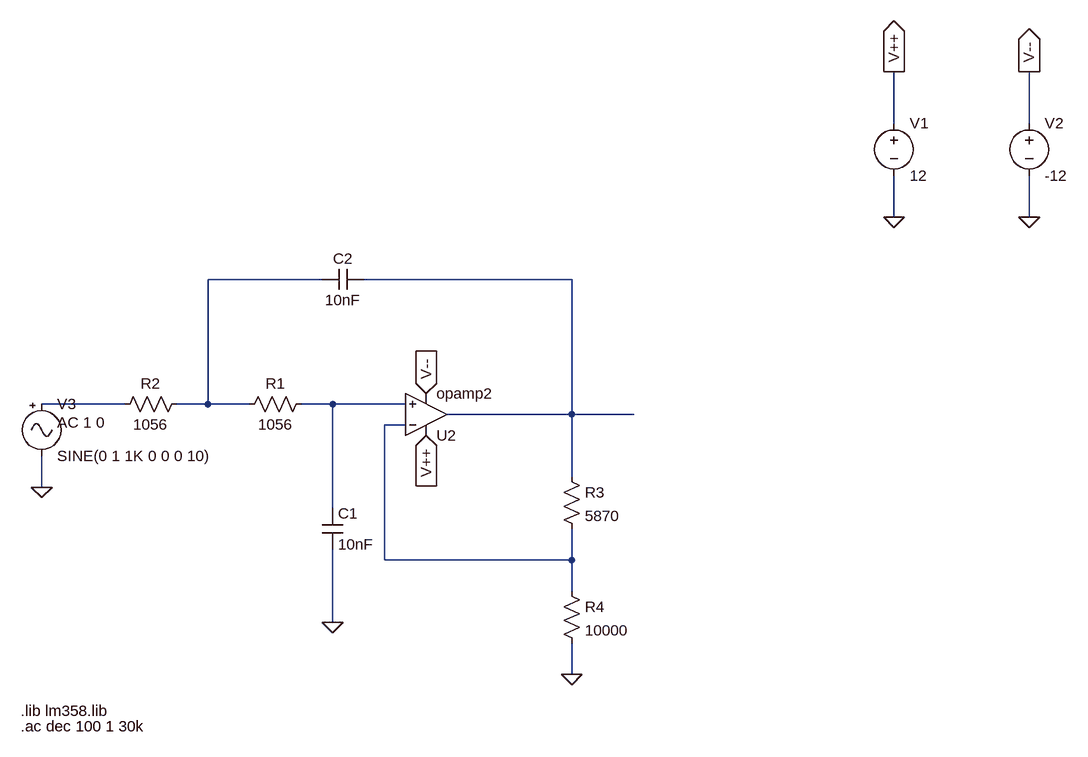
[diagram p0: schematic EEE3090F_2023_lowPassFilter_GNGJOA003.asc]
EEE3090F_2023_lowPassFilter_GNGJOA003.asc, the LTspice schematic file:
Version 4
SHEET 1 1356 680
WIRE 1072 -608 1072 -688
WIRE 1280 -608 1280 -688
WIRE 1072 -464 1072 -528
WIRE 1280 -464 1280 -528
WIRE 192 -368 16 -368
WIRE 576 -368 256 -368
WIRE -112 -176 -240 -176
WIRE 16 -176 16 -368
WIRE 16 -176 -32 -176
WIRE 80 -176 16 -176
WIRE 208 -176 160 -176
WIRE 320 -176 208 -176
WIRE 576 -160 576 -368
WIRE 576 -160 384 -160
WIRE 672 -160 576 -160
WIRE 320 -144 288 -144
WIRE 576 -64 576 -160
WIRE -240 -48 -240 -96
WIRE 208 -16 208 -176
WIRE 288 64 288 -144
WIRE 576 64 576 16
WIRE 576 64 288 64
WIRE 576 112 576 64
WIRE 208 160 208 48
WIRE 576 240 576 192
FLAG 208 160 0
FLAG 576 240 0
FLAG 352 -192 V--
IOPIN 352 -192 In
FLAG 352 -128 V++
IOPIN 352 -128 In
FLAG 1072 -464 0
FLAG 1280 -464 0
FLAG -240 -48 0
FLAG 1072 -688 V++
IOPIN 1072 -688 Out
FLAG 1280 -688 V--
IOPIN 1280 -688 Out
SYMBOL OpAmps\\opamp2 352 -96 M180
SYMATTR InstName U2
SYMBOL res 176 -192 R90
WINDOW 0 0 56 VBottom 2
WINDOW 3 32 56 VTop 2
SYMATTR InstName R1
SYMATTR Value 1056
SYMBOL res -16 -192 R90
WINDOW 0 0 56 VBottom 2
WINDOW 3 32 56 VTop 2
SYMATTR InstName R2
SYMATTR Value 1056
SYMBOL cap 192 -16 R0
SYMATTR InstName C1
SYMATTR Value 10nF
SYMBOL cap 256 -384 R90
WINDOW 0 0 32 VBottom 2
WINDOW 3 32 32 VTop 2
SYMATTR InstName C2
SYMATTR Value 10nF
SYMBOL res 560 -80 R0
SYMATTR InstName R3
SYMATTR Value 5870
SYMBOL res 560 96 R0
SYMATTR InstName R4
SYMATTR Value 10000
SYMBOL voltage 1072 -624 R0
WINDOW 123 0 0 Left 0
WINDOW 39 0 0 Left 0
SYMATTR InstName V1
SYMATTR Value 12
SYMBOL voltage 1280 -624 R0
WINDOW 123 0 0 Left 0
WINDOW 39 0 0 Left 0
SYMATTR InstName V2
SYMATTR Value -12
SYMBOL Misc\\signal -240 -192 R0
WINDOW 123 24 44 Left 2
WINDOW 39 0 0 Left 0
SYMATTR Value2 AC 1 0
SYMATTR InstName V3
SYMATTR Value SINE(0 1 1K 0 0 0 10)
TEXT -272 296 Left 2 !.lib lm358.lib
TEXT -272 320 Left 2 !.ac dec 100 1 30k

The netlist it stands for:
* EEE3090F_2023_lowPassFilter_GNGJOA003.asc
XU2 N004 N005 V++ V-- N002 opamp2  ; pins In+ In- V+ V- OUT
R1 N004 N001 1056
R2 N001 N003 1056
C1 N004 0 10nF
C2 N002 N001 10nF
R3 N002 N005 5870
R4 N005 0 10000
V1 V++ 0 12
V2 V-- 0 -12
V3 N003 0 SINE(0 1 1K 0 0 0 10) AC 1 0
.lib lm358.lib
.ac dec 100 1 30k
.backanno
.end